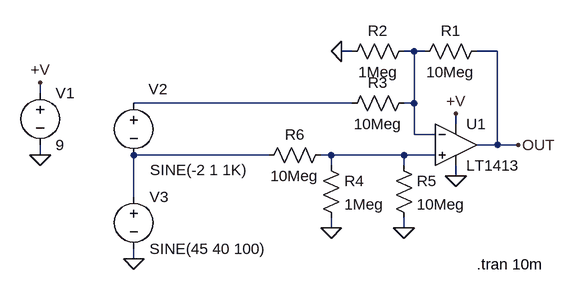
[diagram p0: schematic 1413.asc]
1413.asc, the LTspice schematic file:
Version 4
SHEET 1 896 680
WIRE 32 96 16 96
WIRE 128 96 112 96
WIRE 144 96 128 96
WIRE 256 96 224 96
WIRE -448 160 -448 144
WIRE 32 176 -304 176
WIRE 128 176 128 96
WIRE 128 176 112 176
WIRE 192 208 192 192
WIRE 128 224 128 176
WIRE 160 224 128 224
WIRE 256 240 256 96
WIRE 256 240 224 240
WIRE 288 240 256 240
WIRE -448 256 -448 240
WIRE -96 256 -304 256
WIRE 0 256 -16 256
WIRE 112 256 0 256
WIRE 160 256 112 256
WIRE 0 272 0 256
WIRE 112 272 112 256
WIRE 192 288 192 272
WIRE -304 320 -304 256
WIRE 0 368 0 352
WIRE 112 368 112 352
WIRE -304 416 -304 400
FLAG -448 256 0
FLAG 192 192 +V
FLAG -448 144 +V
FLAG 16 96 0
FLAG 192 288 0
FLAG 112 368 0
FLAG 0 368 0
FLAG -304 416 0
FLAG 288 240 OUT
SYMBOL voltage -448 144 R0
SYMATTR InstName V1
SYMATTR Value 9
SYMBOL res 240 80 R90
WINDOW 0 0 56 VBottom 2
WINDOW 3 32 56 VTop 2
SYMATTR InstName R1
SYMATTR Value 10Meg
SYMBOL res 128 80 R90
WINDOW 0 0 56 VBottom 2
WINDOW 3 32 56 VTop 2
SYMATTR InstName R2
SYMATTR Value 1Meg
SYMBOL opamps\\LT1413 192 176 R0
SYMATTR InstName U1
SYMBOL res 128 160 R90
WINDOW 0 0 56 VBottom 2
WINDOW 3 32 56 VTop 2
SYMATTR InstName R3
SYMATTR Value 10Meg
SYMBOL res -16 256 R0
SYMATTR InstName R4
SYMATTR Value 1Meg
SYMBOL res 96 256 R0
SYMATTR InstName R5
SYMATTR Value 10Meg
SYMBOL res 0 240 R90
WINDOW 0 0 56 VBottom 2
WINDOW 3 32 56 VTop 2
SYMATTR InstName R6
SYMATTR Value 10Meg
SYMBOL voltage -304 160 R0
WINDOW 0 23 -6 Left 2
WINDOW 3 25 119 Left 2
WINDOW 123 0 0 Left 2
WINDOW 39 0 0 Left 2
SYMATTR InstName V2
SYMATTR Value SINE(-2 1 1K)
SYMBOL voltage -304 304 R0
WINDOW 123 0 0 Left 2
WINDOW 39 0 0 Left 2
SYMATTR InstName V3
SYMATTR Value SINE(45 40 100)
TEXT 224 424 Left 2 !.tran 10m

The netlist it stands for:
* 1413.asc
V1 +V 0 9
R1 OUT N001 10Meg
R2 N001 0 1Meg
XU1 N004 N001 +V 0 OUT LT1413  ; pins In+ In- V+ V- OUT
R3 N001 N002 10Meg
R4 N004 0 1Meg
R5 N004 0 10Meg
R6 N004 N003 10Meg
V2 N002 N003 SINE(-2 1 1K)
V3 N003 0 SINE(45 40 100)
.tran 10m
.lib LTC.lib
.backanno
.end